# Altium schematic sheet VCOWaveyRadar.SchDoc: VCO WaveyRadar Schematic
size Letter; Author: Will Vu; CompanyName: Raccoon Wireless; DrawnBy: Will Vu, Raccoon Wireless; Engineer: Will Vu; Organization: Raccoon Wireless; DocumentNumber: 2-05; Revision: 2; SheetNumber: 5; SheetTotal: 15
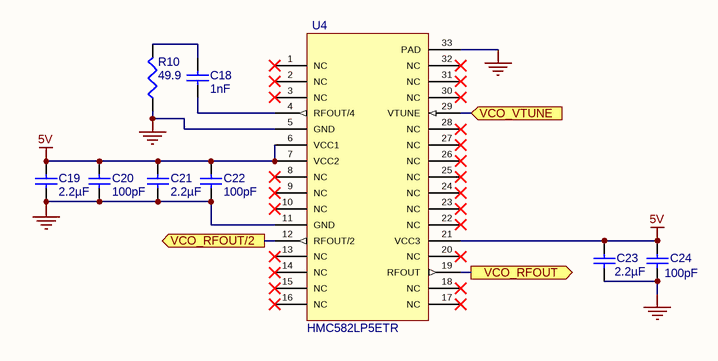
[diagram p0: VCOWaveyRadar.SchDoc]

## Parts
C18  value 1nF  [CAPC0402(1005)33_L]  (hidden comment: Capacitor 1nF +/-20% 50V 0402)
C19  value 2.2µF  [CAPC0402(1005)60_L]  (hidden comment: Capacitor 2,2µF +/-20% 10V 0402)
C20  value 100pF  [CAPC1005X56X25LL10T15]  (hidden comment: 04023A101JAT2A)
C21  value 2.2µF  [CAPC0402(1005)60_L]  (hidden comment: Capacitor 2,2µF +/-20% 10V 0402)
C22  value 100pF  [CAPC1005X56X25LL10T15]  (hidden comment: 04023A101JAT2A)
C23  value 2.2µF  [CAPC0402(1005)60_L]  (hidden comment: Capacitor 2,2µF +/-20% 10V 0402)
C24  value 100pF  [CAPC1005X56X25LL10T15]  (hidden comment: 04023A101JAT2A)
R10  value 49.9  [RESC1005X40X25LL10T10]  (hidden comment: MC00625W0402149R9)
U4  HMC582LP5ETR  [HCP-32-1]

## Ports
VCO_RFOUT (out), VCO_RFOUT/2 (out), VCO_VTUNE (in)

## Nets
5V: C19.1 C20.2 C21.1 C22.2 C23.2 C24.1 U4.6(VCC1) U4.7(VCC2) U4.21(VCC3)
GND: C19.2 C20.1 C21.2 C22.1 C23.1 C24.2 R10.1 U4.5(GND) U4.11(GND) U4.33(PAD)
VCO_RFOUT: U4.19(RFOUT) ; port VCO_RFOUT
VCO_RFOUT/2: U4.12(RFOUT/2) ; port VCO_RFOUT/2
VCO_VTUNE: U4.29(VTUNE) ; port VCO_VTUNE
NetC18_1: C18.1 U4.4(RFOUT/4)
NetC18_2: C18.2 R10.2

Not connected (* = marked no-connect by the designer): U4 1(NC)* 2(NC)* 3(NC)* 8(NC)* 9(NC)* 10(NC)* 13(NC)* 14(NC)* 15(NC)* 16(NC)* 17(NC)* 18(NC)* 20(NC)* 22(NC)* 23(NC)* 24(NC)* 25(NC)* 26(NC)* 27(NC)* 28(NC)* 30(NC)* 31(NC)* 32(NC)*

## Notes on the sheet
- /

## Library data of the parts
C18 = CMP-001-00066-4: Chip Capacitor, 1nF +/-20%, 50V, 0402, Thickness 0.33 mm; Tolerance: 10%; Case/Package: 0402; Max Operating Temperature: 85°C; Min Operating Temperature: -55°C; Mounting Technology: SMT; Voltage Rating: 50V; Pins: 2
C19 C21 C23 = CMP-001-00056-5: Chip Capacitor, 2,2µF +/-20%, 10V, 0402, Thickness 0.6 mm; Tolerance: 10%; Case/Package: 0402; Max Operating Temperature: 85°C; Mounting Technology: SMT; Voltage Rating: 10V; Min Operating Temperature: -55°C; Pins: 2
C20 C22 C24 = CMP-001-00083-2: AVX - 04023A101JAT2A - SMD Multilayer Ceramic Capacitor, 100 pF, 25 V, 0402 [1005 Metric], ± 5%, C0G / NP0, AVX 0402 MLCC
R10 = CMP-009-00186-1: RESISTOR, 49R9, 0.063W, 1%, 0402
U4 = CMP-00025-00008-5: Voltage Controlled Oscillator 11100MHz to 12400MHz 32-Pin QFN T/R